# EasyEDA schematic SCH_long_last_clock_v3_2022-12-24.json
TITLE: Sheet_1; REV: 1.0; Date: 2022-08-21; Sheet: 1/1; Drawn By: hhzrbq; Company: Your Company
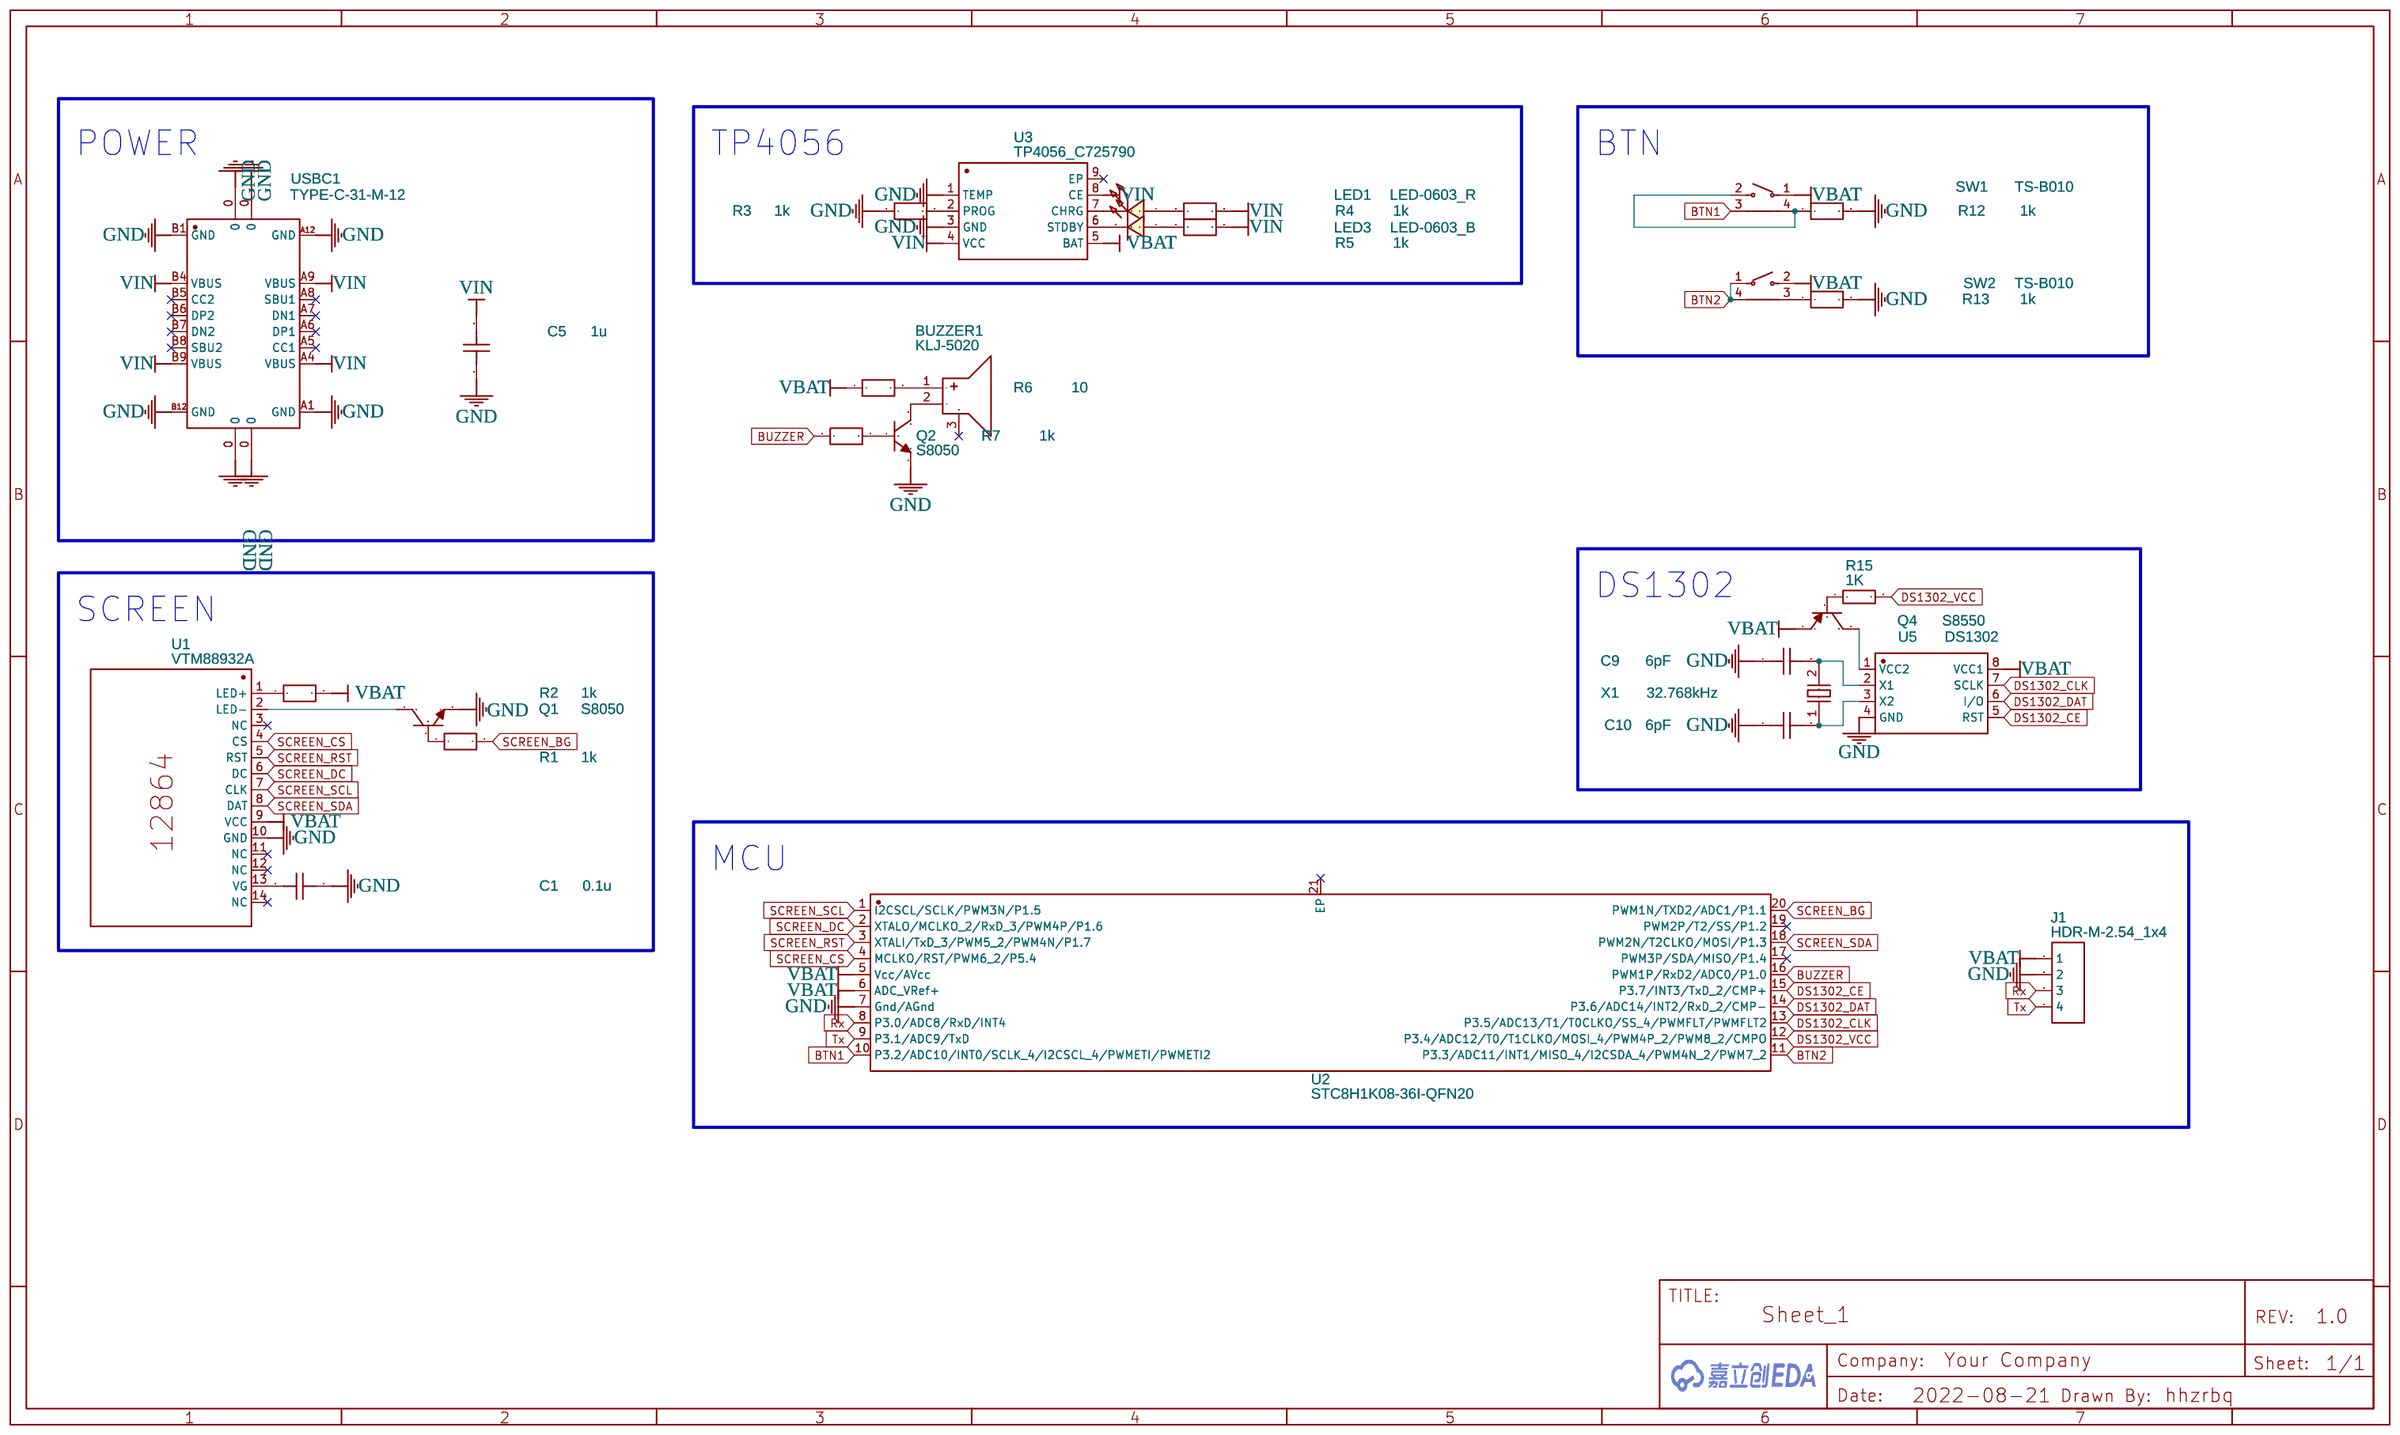
[diagram p0: schematic sheet]

## Parts
BUZZER1  KLJ-5020  [BUZ-SMD_4P-L5.0-W5.0-P3.80-TL]
C1  0.1u  [C0603]
C5  1u  [C0603]
C9  6pF  [C0603]
C10  6pF  [C0603]
J1  HDR-M-2.54_1x4  [HDR-M-2.54_1X4]
LED1  LED-0603_R  [LED0603_RED]
LED3  LED-0603_B  [LED0603_BLUE]
Q1  S8050  [SOT-23-3_L2.9-W1.3-P1.90-LS2.4-BR]
Q2  S8050  [SOT-23-3_L2.9-W1.3-P1.90-LS2.4-BR]
Q4  S8550  [SOT-23-3_L2.9-W1.3-P1.90-LS2.4-BR]
R1  1k  [R0603]
R2  1k  [R0603]
R3  1k  [R0603]
R4  1k  [R0603]
R5  1k  [R0603]
R6  10  [R0603]
R7  1k  [R0603]
R12  1k  [R0603]
R13  1k  [R0603]
R15  1K  [R0603]
SW1  TS-B010  [SW-SMD_TS-B010_8.3]
SW2  TS-B010  [SW-SMD_TS-B010_8.3]
U1  VTM88932A  [FPC-SMD_14P-P1.00-12864]
U2  STC8H1K08-36I-QFN20  [QFN-20_L3.0-W3.0-P0.40-BL-EP1.7]
U3  TP4056_C725790  [ESOP-8_L4.9-W3.9-P1.27-LS6.0-BL-EP]
U5  DS1302  [SOP-8_L4.9-W3.9-P1.27-LS6.0-BL]
USBC1  TYPE-C-31-M-12  [USB-C_SMD-TYPE-C-31-M-12]
X1  32.768kHz  [CRYSTAL-SMD_L3.2-W1.5]

## Library data of the parts
BUZZER1 = KLJ-5020: Supplier: LCSC; Supplier Part: C556937; Manufacturer: KELIKING; Contributor: LCSC; JLCPCB Part Class: Extended Part
C1 C5 C9 C10 = C_0603_US: Contributor: LCEDA_Lib
J1 = HDR-M-2.54_1x4: Supplier Part: C124378; Supplier: LCSC; Contributor: LCEDA_Lib
LED1 = LED-0603_R: Manufacturer: EVERLIGHT(台湾亿光); Manufacturer Part: 19-217/R6C-AL1M2VY/3T; Supplier Part: C72044; Supplier: LCSC; Contributor: LCEDA_01
LED3 = LED-0603_B: Manufacturer: EVERLIGHT(台湾亿光); Manufacturer Part: 19-217/BHC-ZL1M2RY/3T; Supplier Part: C72041; Supplier: LCSC; Contributor: LCEDA_01
Q1 Q2 = S8050_C908252: Supplier: LCSC; Supplier Part: C908252; Manufacturer: FUXINSEMI; Contributor: LCSC; Paste Type: expand
Q4 = S8550_C2894712: Supplier: LCSC; Supplier Part: C2894712; Manufacturer: PUOLOP(迪浦); Contributor: LCSC; JLCPCB Part Class: Extended Part
R1-R7 R12 R13 = R_0603_EU: Contributor: LCEDA_Lib
R15 = RK73B2ATTD102J: Supplier: LCSC; Manufacturer: KOA; Contributor: LCSC; Supplier Part: C159911; JLCPCB Part Class: Extended Part
SW1 SW2 = TD-1100SA-250: Contributor: LCSC
U1 = VTM88932A: Contributor: hhzrbq
U2 = STC8H1K08-36I-QFN20: Supplier: LCSC; Supplier Part: C915674; Manufacturer: STC Micro; Contributor: LCSC; JLCPCB Part Class: Extended Part
U3 = TP4056_C725790: Supplier: LCSC; Supplier Part: C725790; Manufacturer: UMW(Youtai Semiconductor Co., Ltd.); Manufacturer Part: TP4056; Contributor: LCSC; Paste Type: expand
U5 = DS1302M/TR_C910881: Supplier: LCSC; Supplier Part: C910881; Manufacturer: HGC(华冠); Manufacturer Part: DS1302M/TR; Contributor: LCSC; JLCPCB Part Class: Extended Part
USBC1 = TYPE-C-31-M-12: Supplier: LCSC; Supplier Part: C165948; Manufacturer: Rectangular Connectors - Contacts; Contributor: LCSC; JLCPCB Part Class: Extended Part
X1 = Q13FC13500005: Supplier: LCSC; Supplier Part: C841881; Manufacturer: EPSON(爱普生); JLCPCB Part Class: Extended Part; Contributor: LCSC

## Nets
GND: C1.2 C5.1 C9.1 C10.1 J1.2 Q1.2(E) Q2.2(E) R3.1 R12.2 R13.2 U1.10(GND) U2.7(Gnd/AGnd) U3.1(TEMP) U3.3(GND) U5.4(GND) USBC1.0 USBC1.A1(GND) USBC1.A12(GND) USBC1.B1(GND) USBC1.B12(GND)
VBAT: J1.1 Q4.2(E) R2.2 R6.1 SW1.1 SW2.2 U1.9(VCC) U2.5(Vcc/AVcc) U2.6(ADC_VRef+) U3.5(BAT) U5.8(VCC1)
VIN: C5.2 R4.2 R5.2 U3.4(VCC) U3.8(CE) USBC1.A4(VBUS) USBC1.A9(VBUS) USBC1.B4(VBUS) USBC1.B9(VBUS)
BTN1: SW1.3 U2.10(P3.2/ADC10/INT0/SCLK_4/I2CSCL_4/PWMETI/PWMETI2)
BTN2: SW2.1 SW2.4 U2.11(P3.3/ADC11/INT1/MISO_4/I2CSDA_4/PWM4N_2/PWM7_2)
BUZZER: R7.1 U2.16(PWM1P/RxD2/ADC0/P1.0)
DS1302_CE: U2.15(P3.7/INT3/TxD_2/CMP+) U5.5(RST)
DS1302_CLK: U2.13(P3.5/ADC13/T1/T0CLKO/SS_4/PWMFLT/PWMFLT2) U5.7(SCLK)
DS1302_DAT: U2.14(P3.6/ADC14/INT2/RxD_2/CMP-) U5.6(I/O)
DS1302_VCC: R15.2 U2.12(P3.4/ADC12/T0/T1CLKO/MOSI_4/PWM4P_2/PWM8_2/CMPO)
Rx: J1.3 U2.8(P3.0/ADC8/RxD/INT4)
SCREEN_BG: R1.2 U2.20(PWM1N/TXD2/ADC1/P1.1)
SCREEN_CS: U1.4(CS) U2.4(MCLKO/RST/PWM6_2/P5.4)
SCREEN_DC: U1.6(DC) U2.2(XTALO/MCLKO_2/RxD_3/PWM4P/P1.6)
SCREEN_RST: U1.5(RST) U2.3(XTALI/TxD_3/PWM5_2/PWM4N/P1.7)
SCREEN_SCL: U1.7(CLK) U2.1(I2CSCL/SCLK/PWM3N/P1.5)
SCREEN_SDA: U1.8(DAT) U2.18(PWM2N/T2CLKO/MOSI/P1.3)
Tx: J1.4 U2.9(P3.1/ADC9/TxD)
Net-(BUZZER1-1): BUZZER1.1(+) R6.2
Net-(BUZZER1-2): BUZZER1.2(-) Q2.3(C)
Net-(C1-1): C1.1 U1.13(VG)
Net-(C9-2): C9.2 U5.2(X1) X1.2(GND)
Net-(C10-2): C10.2 U5.3(X2) X1.1
Net-(LED1-1): LED1.1 R4.1
Net-(LED1-2): LED1.2 U3.7(CHRG)
Net-(LED3-1): LED3.1 R5.1
Net-(LED3-2): LED3.2 U3.6(STDBY)
Net-(Q1-1): Q1.1(B) R1.1
Net-(Q1-3): Q1.3(C) U1.2(LED-)
Net-(Q2-1): Q2.1(B) R7.2
Net-(Q4-1): Q4.1(B) R15.1
Net-(Q4-3): Q4.3(C) U5.1(VCC2)
Net-(R2-1): R2.1 U1.1(LED+)
Net-(R3-2): R3.2 U3.2(PROG)
Net-(R12-1): R12.1 SW1.2 SW1.4
Net-(R13-1): R13.1 SW2.3

Not connected (* = marked no-connect by the designer): BUZZER1 3(NC)*; U1 3(NC)* 11(NC)* 12(NC)* 14(NC)*; U2 17(PWM3P/SDA/MISO/P1.4)* 19(PWM2P/T2/SS/P1.2)* 21(EP)*; U3 9(EP)*; USBC1 A5(CC1)* A6(DP1)* A7(DN1)* A8(SBU1)* B5(CC2)* B6(DP2)* B7(DN2)* B8(SBU2)*

## Notes on the sheet
- POWER
- TP4056
- BTN
- DS1302
- SCREEN
- MCU
